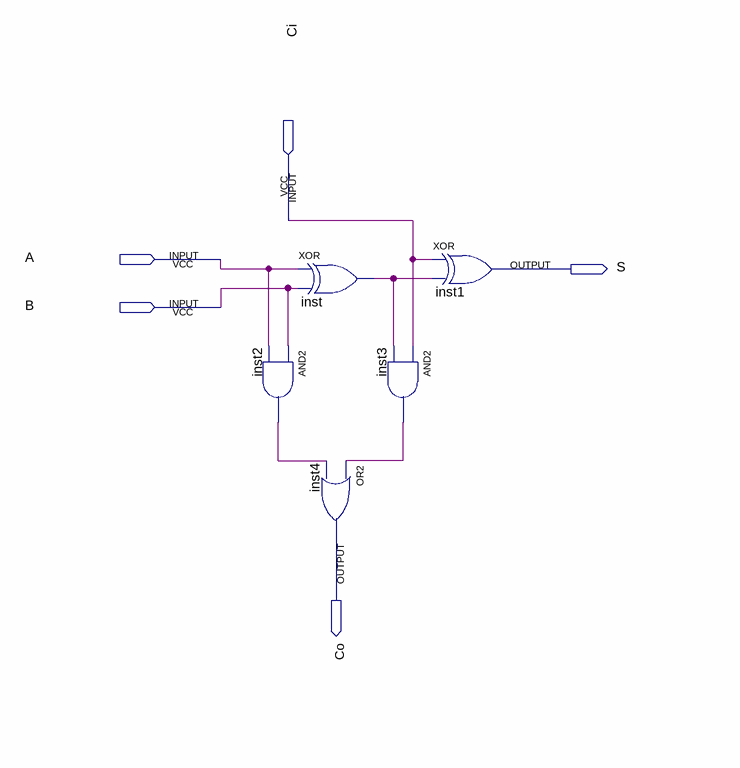
[diagram p0: schematic sheet]
// Quartus schematic soma_1.bdf as structural Verilog: 5 symbols, 5 pins
module soma_1 (
  input  Ci,
  input  A,
  input  B,
  output S,
  output Co
);

  wire inst2_out, inst3_out, inst_out;

  xor inst (inst_out, A, B);
  and inst2 (inst2_out, B, A);
  and inst3 (inst3_out, Ci, inst_out);
  or inst4 (Co, inst3_out, inst2_out);
  xor inst1 (S, Ci, inst_out);
endmodule
